# EAGLE schematic M7065C (EAGLE 6.6.0)
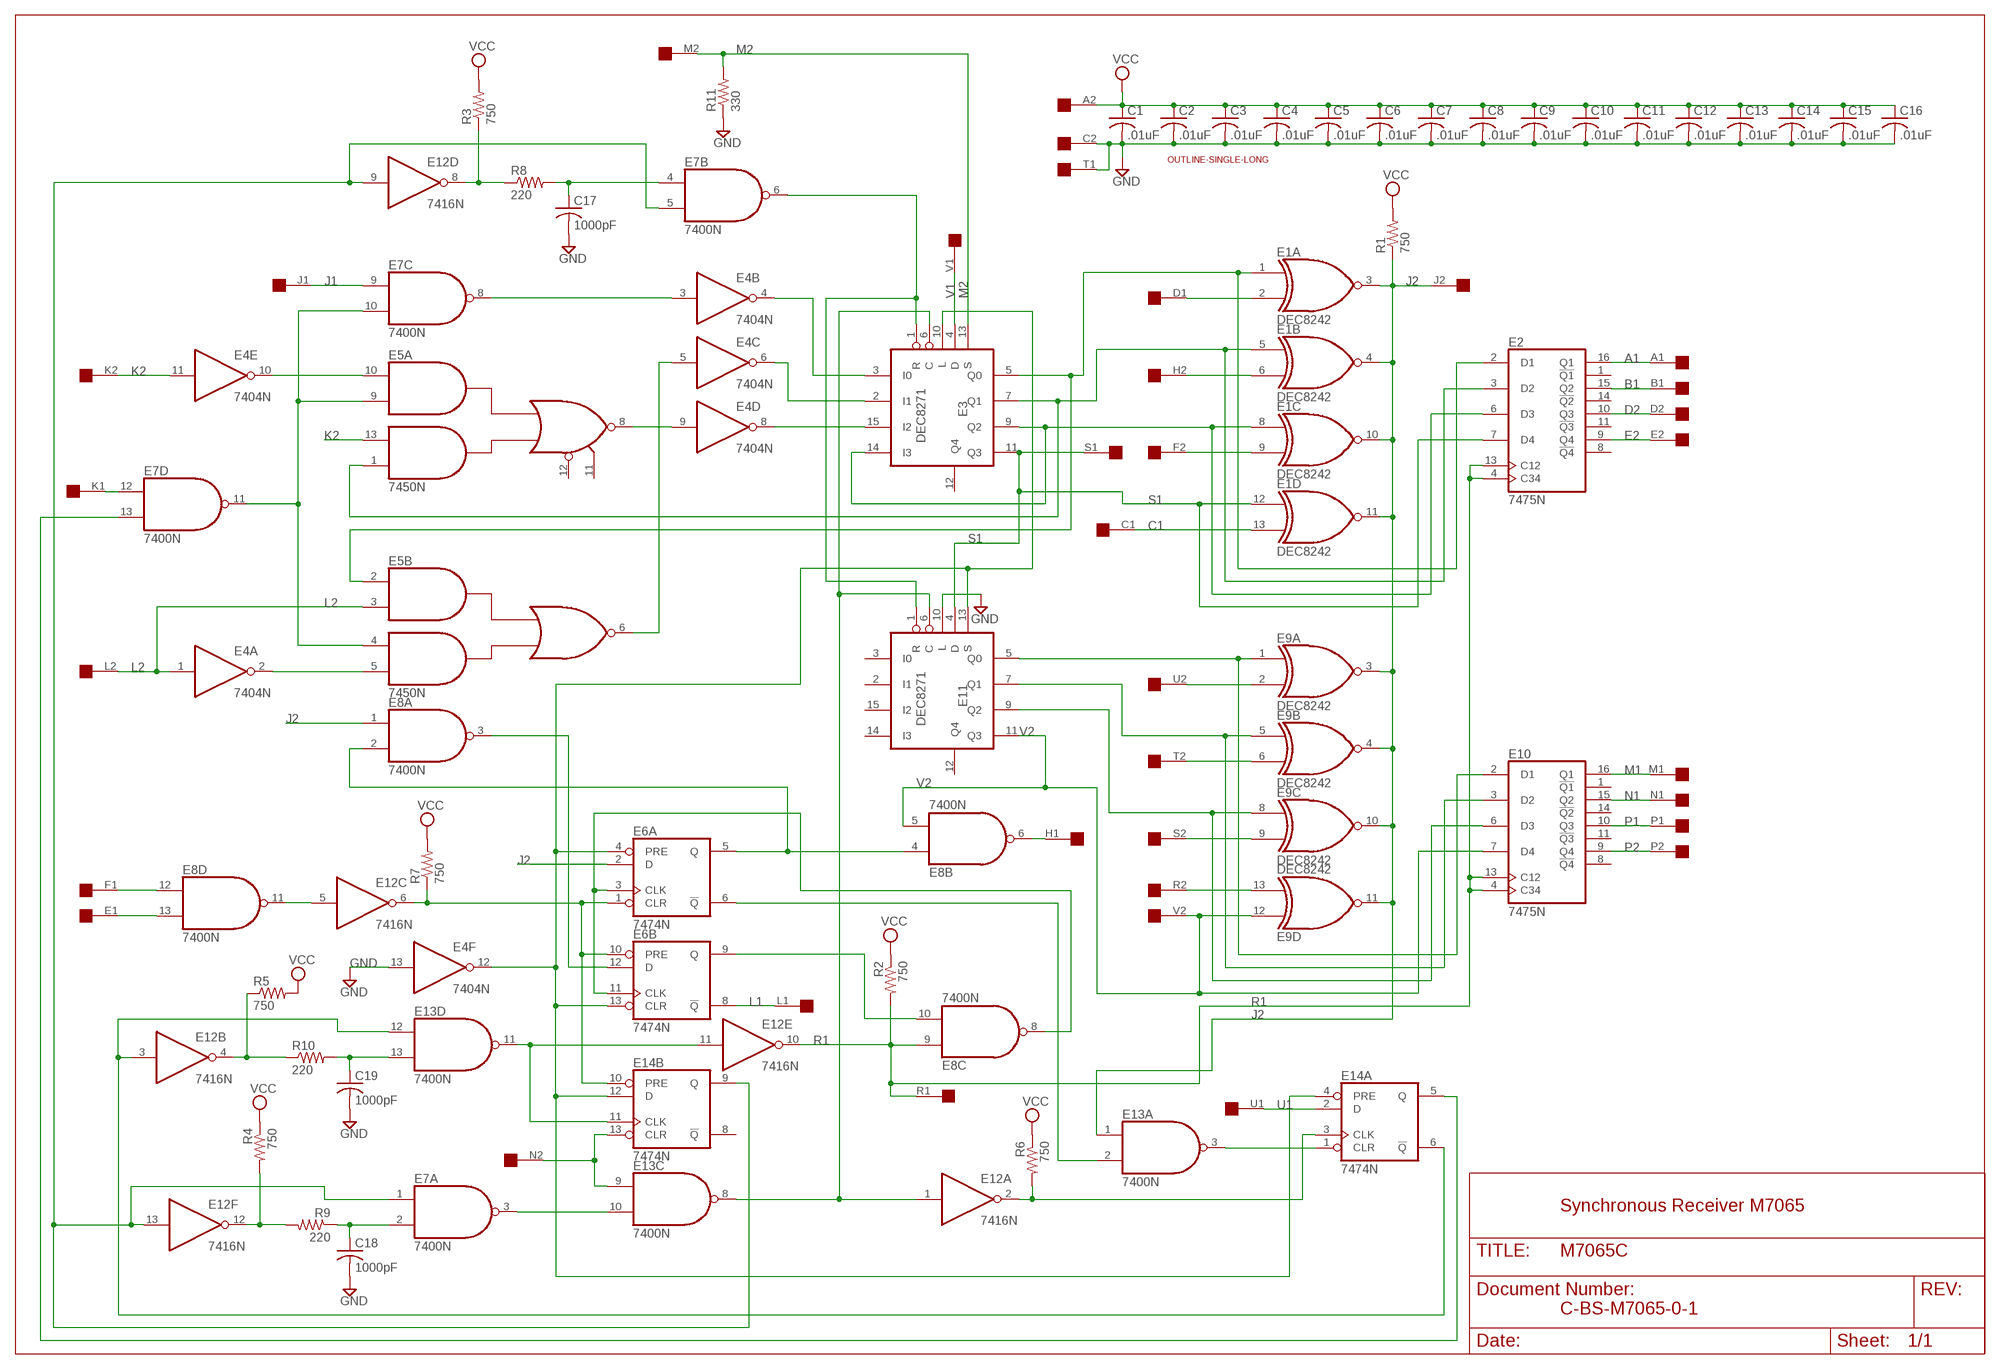
[diagram p0: schematic, sheet 1]

## Parts
C1  .01uF  C-US050-025X075  [C050-025X075]
C2  .01uF  C-US050-025X075  [C050-025X075]
C3  .01uF  C-US050-025X075  [C050-025X075]
C4  .01uF  C-US050-025X075  [C050-025X075]
C5  .01uF  C-US050-025X075  [C050-025X075]
C6  .01uF  C-US050-025X075  [C050-025X075]
C7  .01uF  C-US050-025X075  [C050-025X075]
C8  .01uF  C-US050-025X075  [C050-025X075]
C9  .01uF  C-US050-025X075  [C050-025X075]
C10  .01uF  C-US050-025X075  [C050-025X075]
C11  .01uF  C-US050-025X075  [C050-025X075]
C12  .01uF  C-US050-025X075  [C050-025X075]
C13  .01uF  C-US050-025X075  [C050-025X075]
C14  .01uF  C-US050-025X075  [C050-025X075]
C15  .01uF  C-US050-025X075  [C050-025X075]
C16  .01uF  C-US050-025X075  [C050-025X075]
C17  1000pF  C-US050-025X075  [C050-025X075]
C18  1000pF  C-US050-025X075  [C050-025X075]
C19  1000pF  C-US050-025X075  [C050-025X075]
E1  DEC8242  74LS266N  [DIL14]
E2  7475N  [DIL16]
E3  DEC8271  [DIL16]
E4  7404N  [DIL14]
E5  7450N  [DIL14]
E6  7474N  74S74N  [DIL14]
E7  7400N  [DIL14]
E8  7400N  [DIL14]
E9  DEC8242  74LS266N  [DIL14]
E10  7475N  [DIL16]
E11  DEC8271  [DIL16]
E12  7416N  [DIL14]
E13  7400N  [DIL14]
E14  7474N  74S74N  [DIL14]
R1  750  R-US_0207/10  [0207/10]
R2  750  R-US_0207/10  [0207/10]
R3  750  R-US_0207/10  [0207/10]
R4  750  R-US_0207/10  [0207/10]
R5  750  R-US_0207/10  [0207/10]
R6  750  R-US_0207/10  [0207/10]
R7  750  R-US_0207/10  [0207/10]
R8  220  R-US_0207/10  [0207/10]
R9  220  R-US_0207/10  [0207/10]
R10  220  R-US_0207/10  [0207/10]
R11  330  R-US_0207/10  [0207/10]
U$1  OUTLINE-SINGLE-LONG  [SINGLE-LONG]
U$2  SINGLE  [EDGE-CON2]

## Nets
A1: E2.16(Q1) U$2.A1
B1: E2.15(Q2) U$2.B1
C1: E1.13(D:I1) U$2.C1
D1: E1.2(A:I1) U$2.D1
D2: E2.10(Q3) U$2.D2
E1: E8.13(D:I1) U$2.E1
E2: E2.9(Q4) U$2.E2
F1: E8.12(D:I0) U$2.F1
F2: E1.9(C:I1) U$2.F2
GND [supply]: C1.2 C2.2 C3.2 C4.2 C5.2 C6.2 C7.2 C8.2 C9.2 C10.2 C11.2 C12.2 C13.2 C14.2 C15.2 C16.2 C17.2 C18.2 C19.2 E4.13(F:I) E11.10(L) R11.1 U$2.C2 U$2.T1
H1: E8.6(B:O) U$2.H1
H2: E1.6(B:I1) U$2.H2
J1: E7.9(C:I0) U$2.J1
J2: E1.3(A:O) E1.4(B:O) E1.10(C:O) E1.11(D:O) E6.2(A:D) E8.1(A:I0) E9.3(A:O) E9.4(B:O) E9.10(C:O) E9.11(D:O) E13.1(A:I0) R1.1 U$2.J2
K1: E7.12(D:I0) U$2.K1
K2: E4.11(E:I) E5.13(A:I3) U$2.K2
L1: E6.8(B:!Q) U$2.L1
L2: E4.1(A:I) E5.3(B:I2) U$2.L2
M1: E10.16(Q1) U$2.M1
M2: E3.13(S) R11.2 U$2.M2
N1: E10.15(Q2) U$2.N1
N2: E13.9(C:I0) E14.13(B:CLR) U$2.N2
N$1: E1.8(C:I0) E2.6(D3) E3.9(Q2) E3.14(I3)
N$2: E1.1(A:I0) E2.2(D1) E3.5(Q0) E5.2(B:I1)
N$3: E1.5(B:I0) E2.3(D2) E3.7(Q1) E5.1(A:I4)
N$4: E3.10(L) E4.12(F:O) E6.4(A:PRE) E6.13(B:CLR) E11.13(S) E14.4(A:PRE) E14.12(B:D)
N$5: E6.1(A:CLR) E6.10(B:PRE) E12.6(C:O) E14.10(B:PRE) R7.1
N$15: C17.1 E7.4(B:I0) R8.2
N$16: E7.13(D:I1) E14.5(A:Q)
N$18: C18.1 E7.2(A:I1) R9.1
N$19: E7.1(A:I0) E7.5(B:I1) E12.9(D:I) E12.13(F:I) E14.9(B:Q)
N$21: E4.3(B:I) E7.8(C:O)
N$22: E7.3(A:O) E13.10(C:I1)
N$23: E3.1(R) E7.6(B:O) E11.1(R)
N$24: E5.4(B:I3) E5.9(A:I2) E7.10(C:I1) E7.11(D:O)
N$27: E6.5(A:Q) E8.2(A:I1) E8.4(B:I0)
N$29: E6.9(B:Q) E8.10(C:I1)
N$33: E6.3(A:CLK) E6.11(B:CLK) E8.8(C:O)
N$34: E6.12(B:D) E8.3(A:O)
N$36: E8.11(D:O) E12.5(C:I)
N$37: E9.8(C:I0) E10.6(D3) E11.9(Q2)
N$38: E9.1(A:I0) E10.2(D1) E11.5(Q0)
N$49: E4.9(D:I) E5.8(A:O)
N$51: E4.5(C:I) E5.6(B:O)
N$52: E3.15(I2) E4.8(D:O)
N$56: E4.2(A:O) E5.5(B:I4)
N$58: E4.10(E:O) E5.10(A:I1)
N$60: E3.3(I0) E4.4(B:O)
N$64: E3.2(I1) E4.6(C:O)
N$71: E12.11(E:I) E13.11(D:O) E14.11(B:CLK)
N$72: E12.3(B:I) E13.12(D:I0) E14.6(A:!Q)
N$76: E3.6(C) E11.6(C) E12.1(A:I) E13.8(C:O)
N$77: E12.4(B:O) R5.1 R10.1
N$78: E12.12(F:O) R4.2 R9.2
N$79: E12.8(D:O) R3.1 R8.1
N$80: E12.2(A:O) E14.3(A:CLK) R6.2
N$88: E6.6(A:!Q) E13.2(A:I1)
N$90: C19.1 E13.13(D:I1) R10.2
N$92: E13.3(A:O) E14.1(A:CLR)
N$120: E9.5(B:I0) E10.3(D2) E11.7(Q1)
P1: E10.10(Q3) U$2.P1
P2: E10.9(Q4) U$2.P2
R1: E2.4(C34) E2.13(C12) E8.9(C:I0) E10.4(C34) E10.13(C12) E12.10(E:O) R2.2 U$2.R1
R2: E9.13(D:I1) U$2.R2
S1: E1.12(D:I0) E2.7(D4) E3.11(Q3) E11.4(D) U$2.S1
S2: E9.9(C:I1) U$2.S2
T2: E9.6(B:I1) U$2.T2
U1: E14.2(A:D) U$2.U1
U2: E9.2(A:I1) U$2.U2
V1: E3.4(D) U$2.V1
V2: E8.5(B:I1) E9.12(D:I0) E10.7(D4) E11.11(Q3) U$2.V2
VCC [supply]: C1.1 C2.1 C3.1 C4.1 C5.1 C6.1 C7.1 C8.1 C9.1 C10.1 C11.1 C12.1 C13.1 C14.1 C15.1 C16.1 R1.2 R2.1 R3.2 R4.1 R5.2 R6.1 R7.2 U$2.A2
Unconnected: E2.1(!Q1) E2.8(!Q4) E2.11(!Q3) E2.14(!Q2) E3.12(Q4) E5.11(A:I6) E5.12(A:I5) E10.1(!Q1) E10.8(!Q4) E10.11(!Q3) E10.14(!Q2) E11.2(I1) E11.3(I0) E11.12(Q4) E11.14(I3) E11.15(I2) E13.4(B:I0) E13.5(B:I1) E13.6(B:O) E14.8(B:!Q) U$2.B2

## Notes on the sheet
- Synchronous Receiver M7065
- C-BS-M7065-0-1

## Power pins joined to a net without a drawn wire
GND: E1.7(P:GND) E2.12(GND) E3.8(GND) E4.7(P:GND) E5.7(P:GND) E6.7(P:GND) E7.7(P:GND) E8.7(P:GND) E9.7(P:GND) E10.12(GND) E11.8(GND) E12.7(P:GND) E13.7(P:GND) E14.7(P:GND)
VCC: E1.14(P:VCC) E2.5(VCC) E3.16(VCC) E4.14(P:VCC) E5.14(P:VCC) E6.14(P:VCC) E7.14(P:VCC) E8.14(P:VCC) E9.14(P:VCC) E10.5(VCC) E11.16(VCC) E12.14(P:VCC) E13.14(P:VCC) E14.14(P:VCC)

## Library data of the parts
C1-C19 = rcl:C-US: CAPACITOR, American symbol
E1 E9 = 74xx-us:74*266: Quadruple EXCLUSIVE-NOR (XNOR), open-collector
E2 E10 = 74xx-us:74*75: 4-bit bistable LATCH
E3 E11 = dec-con:DEC8271: Parallel Load Shift Register
E4 = 74xx-us:74*04: Hex INVERTER
E5 = dec-con:74*50: 4-2-3-2 input AND OR INVERTER gates
E6 E14 = 74xx-us:74*74: Dual D type positive edge triggered FLIP FLOP, preset and clear
E7 E8 E13 = 74xx-us:74*00: Quad 2-input NAND gate
E12 = 74xx-us:74*16: Hex INVERTER, open collector, high-voltage
R1-R11 = rcl:R-US_: RESISTOR, American symbol
U$1 = dec-con:OUTLINE-*: Board outlines for DEC boards.
U$2 = dec-con:SINGLE: Single-Height DEC board

## Net classes
1 supply: width 0.813 mm